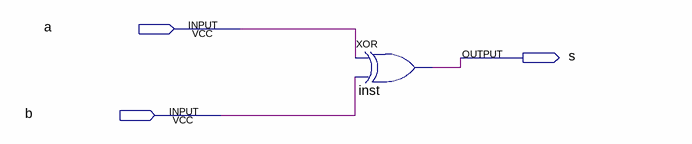
[diagram p0: schematic sheet]
// Quartus schematic Diagrama_bloco_1.bdf as structural Verilog: 1 symbols, 3 pins
module Diagrama_bloco_1 (
  input  a,
  input  b,
  output s
);

  xor inst (s, a, b);
endmodule
